# Altium schematic sheet power.schdoc
size A
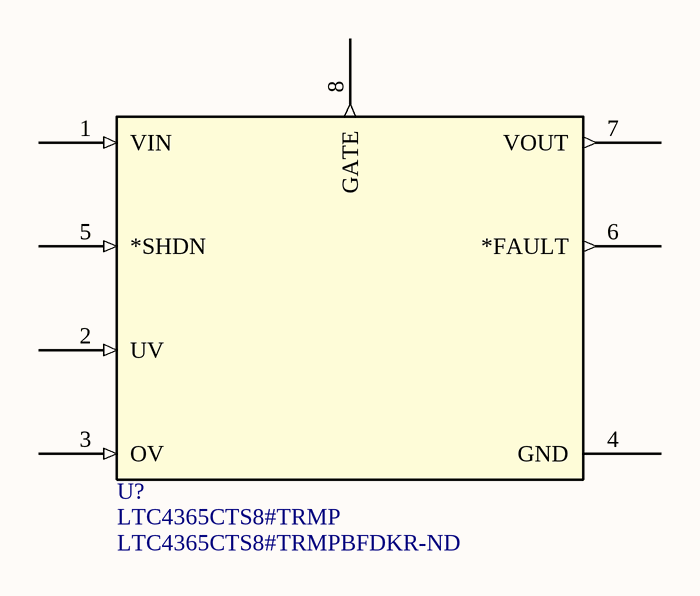
[diagram p0: power.schdoc]

## Parts
U?  LTC4365CTS8#TRMP  Supplier Part Number 1: LTC4365CTS8#TRMPBFDKR-ND  [TSOT-23_TS8]

## Nets

Not connected (* = marked no-connect by the designer): U? 1(VIN) 2(UV) 3(OV) 4(GND) 5(*SHDN) 6(*FAULT) 7(VOUT) 8(GATE)

## Library data of the parts
U? = LTC4365CTS8#TRMP: Overvoltage, / Undervoltage and Reverse / Supply Protection Controller; Manufacturer_Part_Number: LTC4365CTS8#TRMPBF; Vendor: Linear Technology; RefDes: RefDes; Type: DEV; Value: Value; Supplier 1: Digi-Key